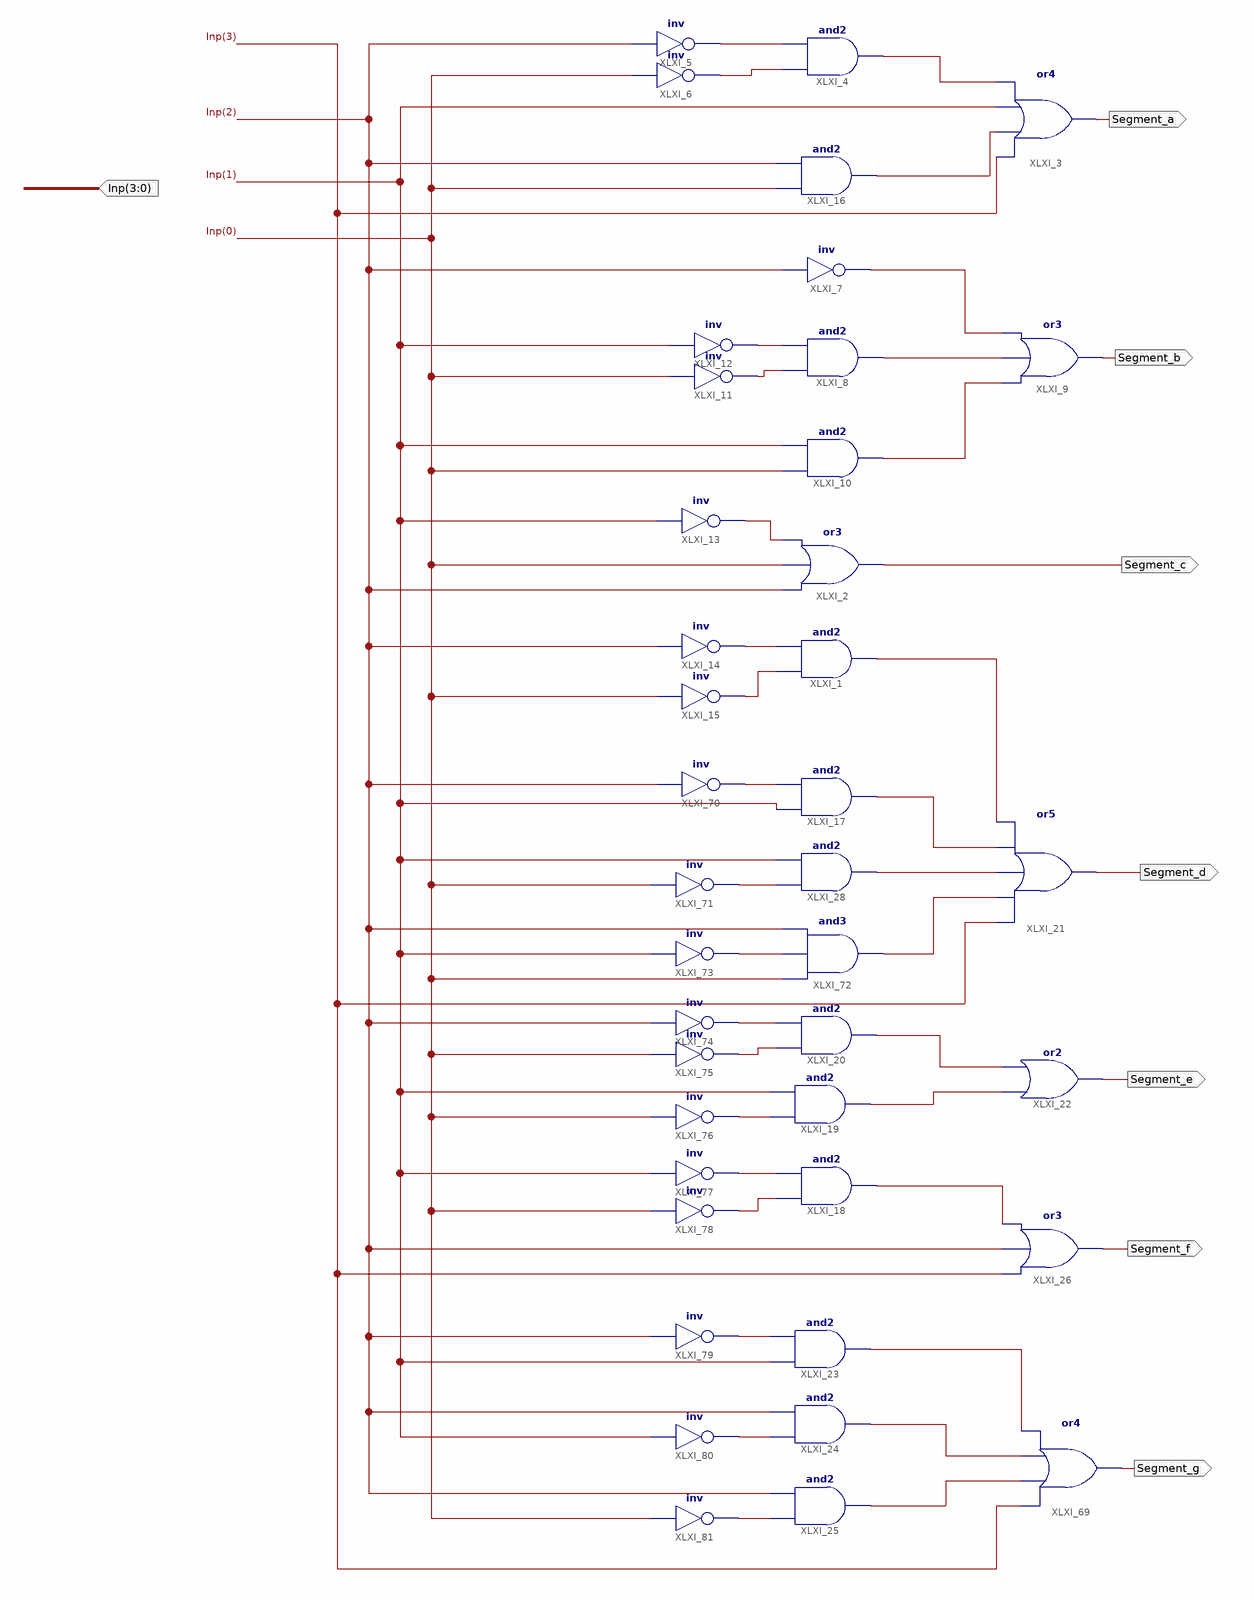
[diagram p0: schematic sheet 1]
// Xilinx ISE schematic BCDto7Seg_1.sch (spartan6) as structural Verilog: 40 symbols, 8 ports
module BCDto7Seg_1 (
  input  [3:0] Inp,
  output Segment_a,
  output Segment_b,
  output Segment_d,
  output Segment_f,
  output Segment_g,
  output Segment_c,
  output Segment_e
);

  wire XLXN_1, XLXN_3, XLXN_4, XLXN_5, XLXN_6, XLXN_7, XLXN_9, XLXN_10, XLXN_11, XLXN_12, XLXN_13, XLXN_15,
       XLXN_16, XLXN_17, XLXN_18, XLXN_19, XLXN_20, XLXN_21, XLXN_22, XLXN_23, XLXN_24, XLXN_25, XLXN_26,
       XLXN_27, XLXN_28, XLXN_29, XLXN_30, XLXN_31, XLXN_32, XLXN_33, XLXN_34, XLXN_35, XLXN_45;

  and XLXI_1 (XLXN_45, XLXN_15, XLXN_13);
  or XLXI_2 (Segment_c, Inp[2], Inp[0], XLXN_12);
  or XLXI_3 (Segment_a, Inp[3], XLXN_3, Inp[1], XLXN_1);
  and XLXI_4 (XLXN_1, XLXN_5, XLXN_4);
  not XLXI_5 (XLXN_4, Inp[2]);
  not XLXI_6 (XLXN_5, Inp[0]);
  not XLXI_7 (XLXN_6, Inp[2]);
  and XLXI_8 (XLXN_7, XLXN_11, XLXN_10);
  or XLXI_9 (Segment_b, XLXN_9, XLXN_7, XLXN_6);
  and XLXI_10 (XLXN_9, Inp[0], Inp[1]);
  not XLXI_11 (XLXN_11, Inp[0]);
  not XLXI_12 (XLXN_10, Inp[1]);
  not XLXI_13 (XLXN_12, Inp[1]);
  not XLXI_14 (XLXN_13, Inp[2]);
  not XLXI_15 (XLXN_15, Inp[0]);
  and XLXI_16 (XLXN_3, Inp[0], Inp[2]);
  and XLXI_17 (XLXN_16, Inp[1], XLXN_25);
  and XLXI_18 (XLXN_21, XLXN_32, XLXN_31);
  and XLXI_19 (XLXN_20, XLXN_30, Inp[1]);
  and XLXI_20 (XLXN_19, XLXN_29, XLXN_28);
  or XLXI_21 (Segment_d, Inp[3], XLXN_18, XLXN_17, XLXN_16, XLXN_45);
  or XLXI_22 (Segment_e, XLXN_20, XLXN_19);
  and XLXI_23 (XLXN_22, Inp[1], XLXN_33);
  and XLXI_24 (XLXN_23, XLXN_34, Inp[2]);
  and XLXI_25 (XLXN_24, XLXN_35, Inp[2]);
  or XLXI_26 (Segment_f, Inp[3], Inp[2], XLXN_21);
  or XLXI_69 (Segment_g, Inp[3], XLXN_24, XLXN_23, XLXN_22);
  and XLXI_28 (XLXN_17, XLXN_26, Inp[1]);
  not XLXI_70 (XLXN_25, Inp[2]);
  not XLXI_71 (XLXN_26, Inp[0]);
  and XLXI_72 (XLXN_18, Inp[0], XLXN_27, Inp[2]);
  not XLXI_73 (XLXN_27, Inp[1]);
  not XLXI_75 (XLXN_29, Inp[0]);
  not XLXI_76 (XLXN_30, Inp[0]);
  not XLXI_77 (XLXN_31, Inp[1]);
  not XLXI_78 (XLXN_32, Inp[0]);
  not XLXI_79 (XLXN_33, Inp[2]);
  not XLXI_80 (XLXN_34, Inp[1]);
  not XLXI_81 (XLXN_35, Inp[0]);
  not XLXI_74 (XLXN_28, Inp[2]);
endmodule
